# Altium schematic sheet Converter.SchDoc
size A4
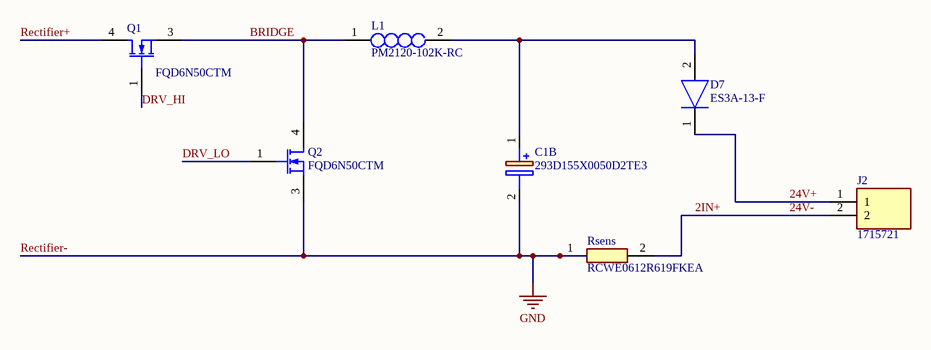
[diagram p0: Converter.SchDoc]

## Parts
C1B  293D155X0050D2TE3  [CAPPM7343X310N]
D7  ES3A-13-F  [DIOM7959X250N]
J2  1715721  [1715721]
L1  PM2120-102K-RC  [PM2120271KRC]
Q1  FQD6N50CTM  [DPAK3]
Q2  FQD6N50CTM  [DPAK3]
Rsens  RCWE0612R619FKEA  [RESC1632X70N]

## Nets
Rectifier-: C1B.2(-) Q2.3(S) Rsens.1  [also labelled GND]
24V+: D7.1(K) J2.1
24V-: J2.2 Rsens.2  [also labelled 2IN+]
BRIDGE: L1.1 Q1.3(S) Q2.4(D)
DRV_HI: Q1.1(G)
DRV_LO: Q2.1(G)
Rectifier+: Q1.4(D)
NetC1B_1: C1B.1(+) D7.2(A) L1.2

## Library data of the parts
C1B = 293D155X0050D2TE3: Capacitor Polarised; Manufacturer_Name: Vishay; Datasheet Link: http://www.vishay.com/doc?40002; Height: 3.1mm; Manufacturer_Part_Number: 293D155X0050D2TE3; Mouser Part Number: N/A; Mouser Price/Stock: https://www.mouser.co.uk/ProductDetail/Vishay-Sprague/293D155X0050D2TE3/?qs=dG4nGvFc7P9fHhfu7ckfoQ%3D%3D
D7 = ES3A-13-F: Diode; Manufacturer_Name: Diodes Inc.; Datasheet Link: https://www.arrow.com/en/products/es3a-13-f/diodes-incorporated; Height: 2.5mm; Manufacturer_Part_Number: ES3A-13-F; Mouser Part Number: 621-ES3A-F; Mouser Price/Stock: https://www.mouser.co.uk/ProductDetail/Diodes-Incorporated/ES3A-13-F/?qs=fsGQ151tk6Wkygd1WaXOlQ%3D%3D; Arrow Part Number: ES3A-13-F; Arrow Price/Stock: https://www.arrow.com/en/products/es3a-13-f/diodes-incorporated
J2 = 1715721: Connector; Manufacturer_Name: Phoenix Contact; Datasheet Link: https://componentsearchengine.com/Datasheets/2/1715721.pdf; Height: 13.95mm; Manufacturer_Part_Number: 1715721; Mouser Part Number: 651-1715721; Mouser Price/Stock: https://www.mouser.co.uk/ProductDetail/Phoenix-Contact/1715721/?qs=BYlwlsDsB%2FqgmKyTCSucHg%3D%3D; Arrow Part Number: 1715721; Arrow Price/Stock: https://www.arrow.com/en/products/1715721/phoenix-contact
L1 = PM2120-102K-RC: Inductor; Manufacturer_Name: Bourns; Datasheet Link: https://www.bourns.com/pdfs/pm2120_series.pdf; Height: 20.32mm; Manufacturer_Part_Number: PM2120-102K-RC
Q1 Q2 = FQD6N50CTM: Transistor, Mosfet, N-Channel, 500V V(Br)Dss, 4.5A I(D), To-252Aa; Manufacturer: ON Semiconductor / Fairchild; Rise Time: 35ns; Rds On Max: 1.2R; Input Capacitance: 700pF; Fall Time: 45ns; Power Dissipation: 2.5W; Turn-Off Delay Time: 55ns; Gate to Source Voltage (Vgs): 30V; Element Configuration: Single; Turn-On Delay Time: 10ns; Number of Elements: 1; Supplier 1: Digi-Key; Manufacturer Part Number: FQD6N50CTM; RoHS: Yes; Category: MOSFETs; Stock 1: 650; Pricing 1: 1=0,95000, 10=0,77600, 25=0,76200, 100=0,60380, 500=0,51176, 1000=0,41688 (USD); Mount: Surface Mount; Case/Package: DPAK; Number of Pins: 3; Weight: 0.26037g; Min Operating Temperature: -55°C; Max Operating Temperature: 150°C; Package Quantity: 1; Packaging: Tape and Reel; Continuous Drain Current (ID): 4.5A; Drain to Source Breakdown Voltage: 500V; Drain to Source Resistance: 1.2R; Drain to Source Voltage (Vdss): 500V; Max Power Dissipation: 2.5W; Voltage Rating (DC): 500V; Current Rating: 4.5A; Radiation Hardening: No; Lead Free: Lead Free; ComponentLink1URL: https://datasheet.ciiva.com/11175/fqd6n50c-11175856.pdf?src-supplier=Avnet; ComponentLink1Description: https://datasheet.ciiva.com/11175/fqd6n50c-11175856.pdf?src-supplier=Avnet; ComponentLink2URL: https://datasheet.ciiva.com/4445/fqd6n50c-110706-4445904.pdf?src-supplier=Mouser; ComponentLink2Description: https://datasheet.ciiva.com/4445/fqd6n50c-110706-4445904.pdf?src-supplier=Mouser; ComponentLink3URL: https://datasheet.ciiva.com/26791/fqd6n50ctm-26791044.pdf?src-supplier=IIIC; ComponentLink3Description: https://datasheet.ciiva.com/26791/fqd6n50ctm-26791044.pdf?src-supplier=IIIC; Supplier Part Number 1: FQD6N50CTMCT-ND
Rsens = RCWE0612R619FKEA: Resistor; Manufacturer_Name: Vishay; Datasheet Link: https://componentsearchengine.com/Datasheets/2/RCWE0612R619FKEA.pdf; Height: 0.7mm; Manufacturer_Part_Number: RCWE0612R619FKEA; Mouser Part Number: 71-RCWE0612R619FKEA; Mouser Price/Stock: https://www.mouser.co.uk/ProductDetail/Vishay-Dale/RCWE0612R619FKEA/?qs=bvCpHSZmQjl4FfGNZ007qQ%3D%3D; Arrow Part Number: RCWE0612R619FKEA; Arrow Price/Stock: https://www.arrow.com/en/products/rcwe0612r619fkea/vishay